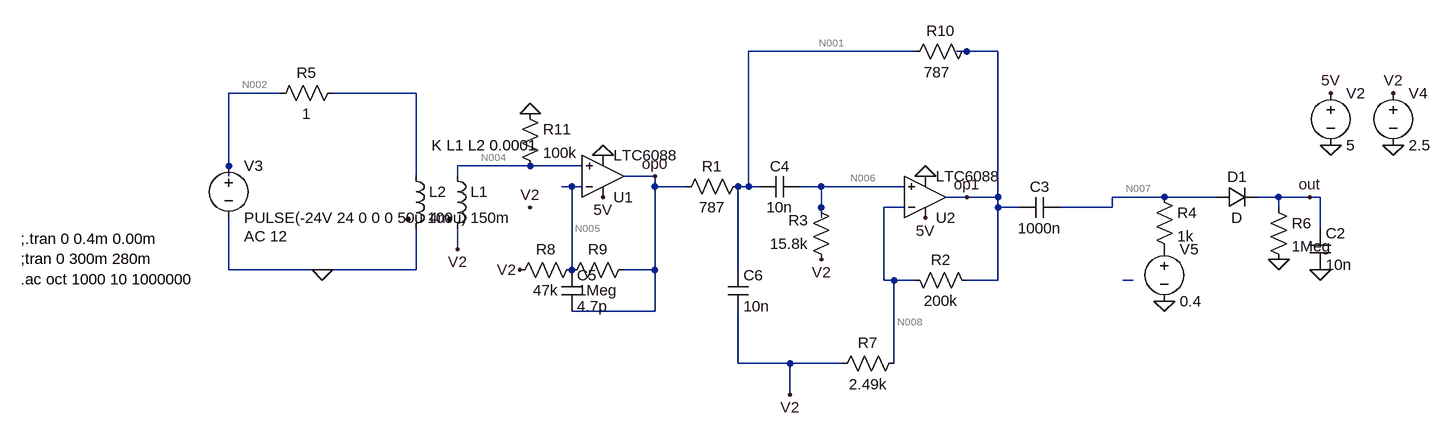
[diagram p0: schematic pw_ti2.asc]
pw_ti2.asc, the LTspice schematic file:
Version 4
SHEET 1 2056 680
WIRE 480 -160 224 -160
WIRE 560 -160 544 -160
WIRE 608 -160 560 -160
WIRE -496 -96 -576 -96
WIRE -288 -96 -416 -96
WIRE -576 16 -576 -96
WIRE -112 16 -224 16
WIRE -32 16 -112 16
WIRE -576 32 -576 16
WIRE -288 32 -288 -96
WIRE -224 32 -224 16
WIRE 80 32 32 32
WIRE -48 48 -64 48
WIRE -32 48 -48 48
WIRE 80 48 80 32
WIRE 128 48 80 48
WIRE 224 48 224 -160
WIRE 224 48 208 48
WIRE 240 48 224 48
WIRE 336 48 304 48
WIRE 464 48 336 48
WIRE 560 64 528 64
WIRE 608 64 608 -160
WIRE 608 64 560 64
WIRE 864 64 784 64
WIRE 944 64 864 64
WIRE 1040 64 1008 64
WIRE 1088 64 1040 64
WIRE 1104 64 1088 64
WIRE 336 80 336 48
WIRE 464 80 432 80
WIRE 608 80 608 64
WIRE 640 80 608 80
WIRE 784 80 784 64
WIRE 784 80 704 80
WIRE 1040 80 1040 64
WIRE 336 96 336 80
WIRE 1104 112 1104 64
WIRE -224 144 -224 112
WIRE -576 176 -576 96
WIRE -432 176 -576 176
WIRE -288 176 -288 112
WIRE -288 176 -432 176
WIRE -48 176 -48 48
WIRE 80 176 80 48
WIRE 80 176 32 176
WIRE 208 176 208 48
WIRE 432 192 432 80
WIRE 448 192 432 192
WIRE 480 192 448 192
WIRE 608 192 608 80
WIRE 608 192 560 192
WIRE 816 192 800 192
WIRE 80 240 80 176
WIRE 80 240 -48 240
WIRE 208 320 208 240
WIRE 288 320 208 320
WIRE 368 320 288 320
WIRE 448 320 448 192
WIRE 288 368 288 320
FLAG 560 64 op1
FLAG 496 32 0
FLAG 496 96 5V
FLAG 1120 -16 0
FLAG 1120 -96 5V
FLAG 1216 -16 0
FLAG 1216 -96 V2
FLAG -224 144 V2
FLAG 1104 176 0
FLAG 1040 160 0
FLAG 1088 64 out
FLAG 336 160 V2
FLAG 288 368 V2
FLAG 864 224 0
FLAG -432 176 0
FLAG 0 0 0
FLAG 0 64 5V
FLAG -128 176 V2
FLAG 80 32 op0
FLAG -112 80 V2
FLAG -112 -64 0
SYMBOL ind2 -240 16 R0
SYMATTR InstName L1
SYMATTR Value 150m
SYMATTR Type ind
SYMBOL res 224 32 R90
WINDOW 0 0 56 VBottom 2
WINDOW 3 32 56 VTop 2
SYMATTR InstName R1
SYMATTR Value 787
SYMBOL voltage -576 0 R0
WINDOW 123 24 124 Left 2
WINDOW 39 0 0 Left 0
SYMATTR Value2 AC 12
SYMATTR InstName V3
SYMATTR Value PULSE(-24V 24 0 0 0 50u 100u)
SYMBOL res 576 208 M270
WINDOW 0 32 56 VTop 2
WINDOW 3 0 56 VBottom 2
SYMATTR InstName R2
SYMATTR Value 200k
SYMBOL Opamps\\LTC6088 496 64 M180
SYMATTR InstName U2
SYMBOL voltage 1120 -112 R0
WINDOW 123 0 0 Left 0
WINDOW 39 0 0 Left 0
SYMATTR InstName V2
SYMATTR Value 5
SYMBOL voltage 1216 -112 R0
WINDOW 123 0 0 Left 0
WINDOW 39 0 0 Left 0
SYMATTR InstName V4
SYMATTR Value 2.5
SYMBOL diode 944 80 R270
WINDOW 0 32 32 VTop 2
WINDOW 3 0 32 VBottom 2
SYMATTR InstName D1
SYMBOL cap 1088 112 R0
SYMATTR InstName C2
SYMATTR Value 10n
SYMBOL res 1024 64 R0
SYMATTR InstName R6
SYMATTR Value 1Meg
SYMBOL cap 704 64 R90
WINDOW 0 0 32 VBottom 2
WINDOW 3 32 32 VTop 2
SYMATTR InstName C3
SYMATTR Value 1000n
SYMBOL cap 304 32 R90
WINDOW 0 0 32 VBottom 2
WINDOW 3 32 32 VTop 2
SYMATTR InstName C4
SYMATTR Value 10n
SYMBOL res 352 176 R180
WINDOW 0 36 76 Left 2
WINDOW 3 36 40 Left 2
SYMATTR InstName R3
SYMATTR Value 15.8k
SYMBOL res 464 304 R90
WINDOW 0 0 56 VBottom 2
WINDOW 3 32 56 VTop 2
SYMATTR InstName R7
SYMATTR Value 2.49k
SYMBOL res 848 48 R0
SYMATTR InstName R4
SYMATTR Value 1k
SYMBOL voltage 864 128 R0
WINDOW 123 0 0 Left 0
WINDOW 39 0 0 Left 0
SYMATTR InstName V5
SYMATTR Value 0.4
SYMBOL ind2 -304 16 R0
SYMATTR InstName L2
SYMATTR Value 4m
SYMATTR Type ind
SYMBOL res -400 -112 R90
WINDOW 0 0 56 VBottom 2
WINDOW 3 32 56 VTop 2
SYMATTR InstName R5
SYMATTR Value 1
SYMBOL Opamps\\LTC6088 0 32 M180
SYMATTR InstName U1
SYMBOL res -32 160 R90
WINDOW 0 0 56 VBottom 2
WINDOW 3 32 56 VTop 2
SYMATTR InstName R8
SYMATTR Value 47k
SYMBOL res 48 160 R90
WINDOW 0 0 56 VBottom 2
WINDOW 3 32 56 VTop 2
SYMATTR InstName R9
SYMATTR Value 1Meg
SYMBOL cap -64 176 R0
SYMATTR InstName C5
SYMATTR Value 4.7p
SYMBOL cap 192 176 R0
SYMATTR InstName C6
SYMATTR Value 10n
SYMBOL res 576 -176 R90
WINDOW 0 0 56 VBottom 2
WINDOW 3 32 62 VTop 2
SYMATTR InstName R10
SYMATTR Value 787
SYMBOL res -128 -80 R0
SYMATTR InstName R11
SYMATTR Value 100k
TEXT -896 128 Left 2 !;.tran 0 0.4m 0.00m\n;tran 0 300m 280m\n.ac oct 1000 10 1000000
TEXT -264 -16 Left 2 !K L1 L2 0.0001

The netlist it stands for:
* pw_ti2.asc
L1 N004 V2 150m
R1 N001 op0 787
V3 N002 0 PULSE(-24V 24 0 0 0 50u 100u) AC 12
R2 op1 N008 200k
* U2: LTC6088 (symbol Opamps\LTC6088 not available, pins judged from their places): In+=N006 In-=N008 V+=5V V-=0 OUT=op1
V2 5V 0 5
V4 V2 0 2.5
D1 N007 out D
C2 out 0 10n
R6 out 0 1Meg
C3 N007 op1 1000n
C4 N006 N001 10n
R3 V2 N006 15.8k
R7 N008 V2 2.49k
R4 N007 P001 1k
V5 P001 0 0.4
L2 N003 0 4m
R5 N003 N002 1
* U1: LTC6088 (symbol Opamps\LTC6088 not available, pins judged from their places): In+=N004 In-=N005 V+=5V V-=0 OUT=op0
R8 N005 V2 47k
R9 op0 N005 1Meg
C5 N005 op0 4.7p
C6 N001 V2 10n
R10 op1 N001 787
R11 0 N004 100k
.model D D
.lib standard.dio
;.tran 0 0.4m 0.00m
;tran 0 300m 280m
.ac oct 1000 10 1000000
K L1 L2 0.0001
.backanno
.end

* Results of the author's LTspice run, read from the files saved beside the schematic
* Operating Point, zero values left out:
*   V(n004) = 2.5 V
*   V(v2) = 2.5 V
*   V(n001) = 2.5 V
*   V(op0) = 2.5 V
*   V(n002) = -24 V
*   V(op1) = 2.5 V
*   V(n008) = 2.5 V
*   V(5v) = 5 V
*   V(n006) = 2.5 V
*   V(n007) = 400 mV
*   V(out) = 22.11 mV
*   V(p001) = 400 mV
*   V(n005) = 2.5 V
*   I(D1) = 22.11 nA
*   I(L2) = -24 A
*   I(L1) = -25 µA
*   I(R11) = -25 µA
*   I(R10) = 12.34 nA
*   I(R9) = 13.13 pA
*   I(R8) = 9.631 pA
*   I(R5) = 24 A
*   I(R4) = -22.11 nA
*   I(R7) = 159.6 pA
*   I(R3) = 3.5 pA
*   I(R6) = 22.11 nA
*   I(R2) = 163.1 pA
*   I(R1) = 12.34 nA
*   I(V5) = -22.11 nA
*   I(V4) = -25 µA
*   I(V2) = -2.098 mA
*   I(V3) = 24 A
*   Ix(u2:1) = 3.5 pA
*   Ix(u2:2) = 3.5 pA
*   Ix(u2:3) = 1.049 mA
*   Ix(u2:4) = -1.049 mA
*   Ix(u2:5) = -12.51 nA
*   Ix(u1:1) = 3.5 pA
*   Ix(u1:2) = 3.5 pA
*   Ix(u1:3) = 1.049 mA
*   Ix(u1:4) = -1.049 mA
*   Ix(u1:5) = 12.33 nA